# EAGLE schematic CarloopXL-v3.0 (EAGLE 7.5.0)
DATABASE: /home/monkbroc/Electronics/eagle/PARTSDB.tsv
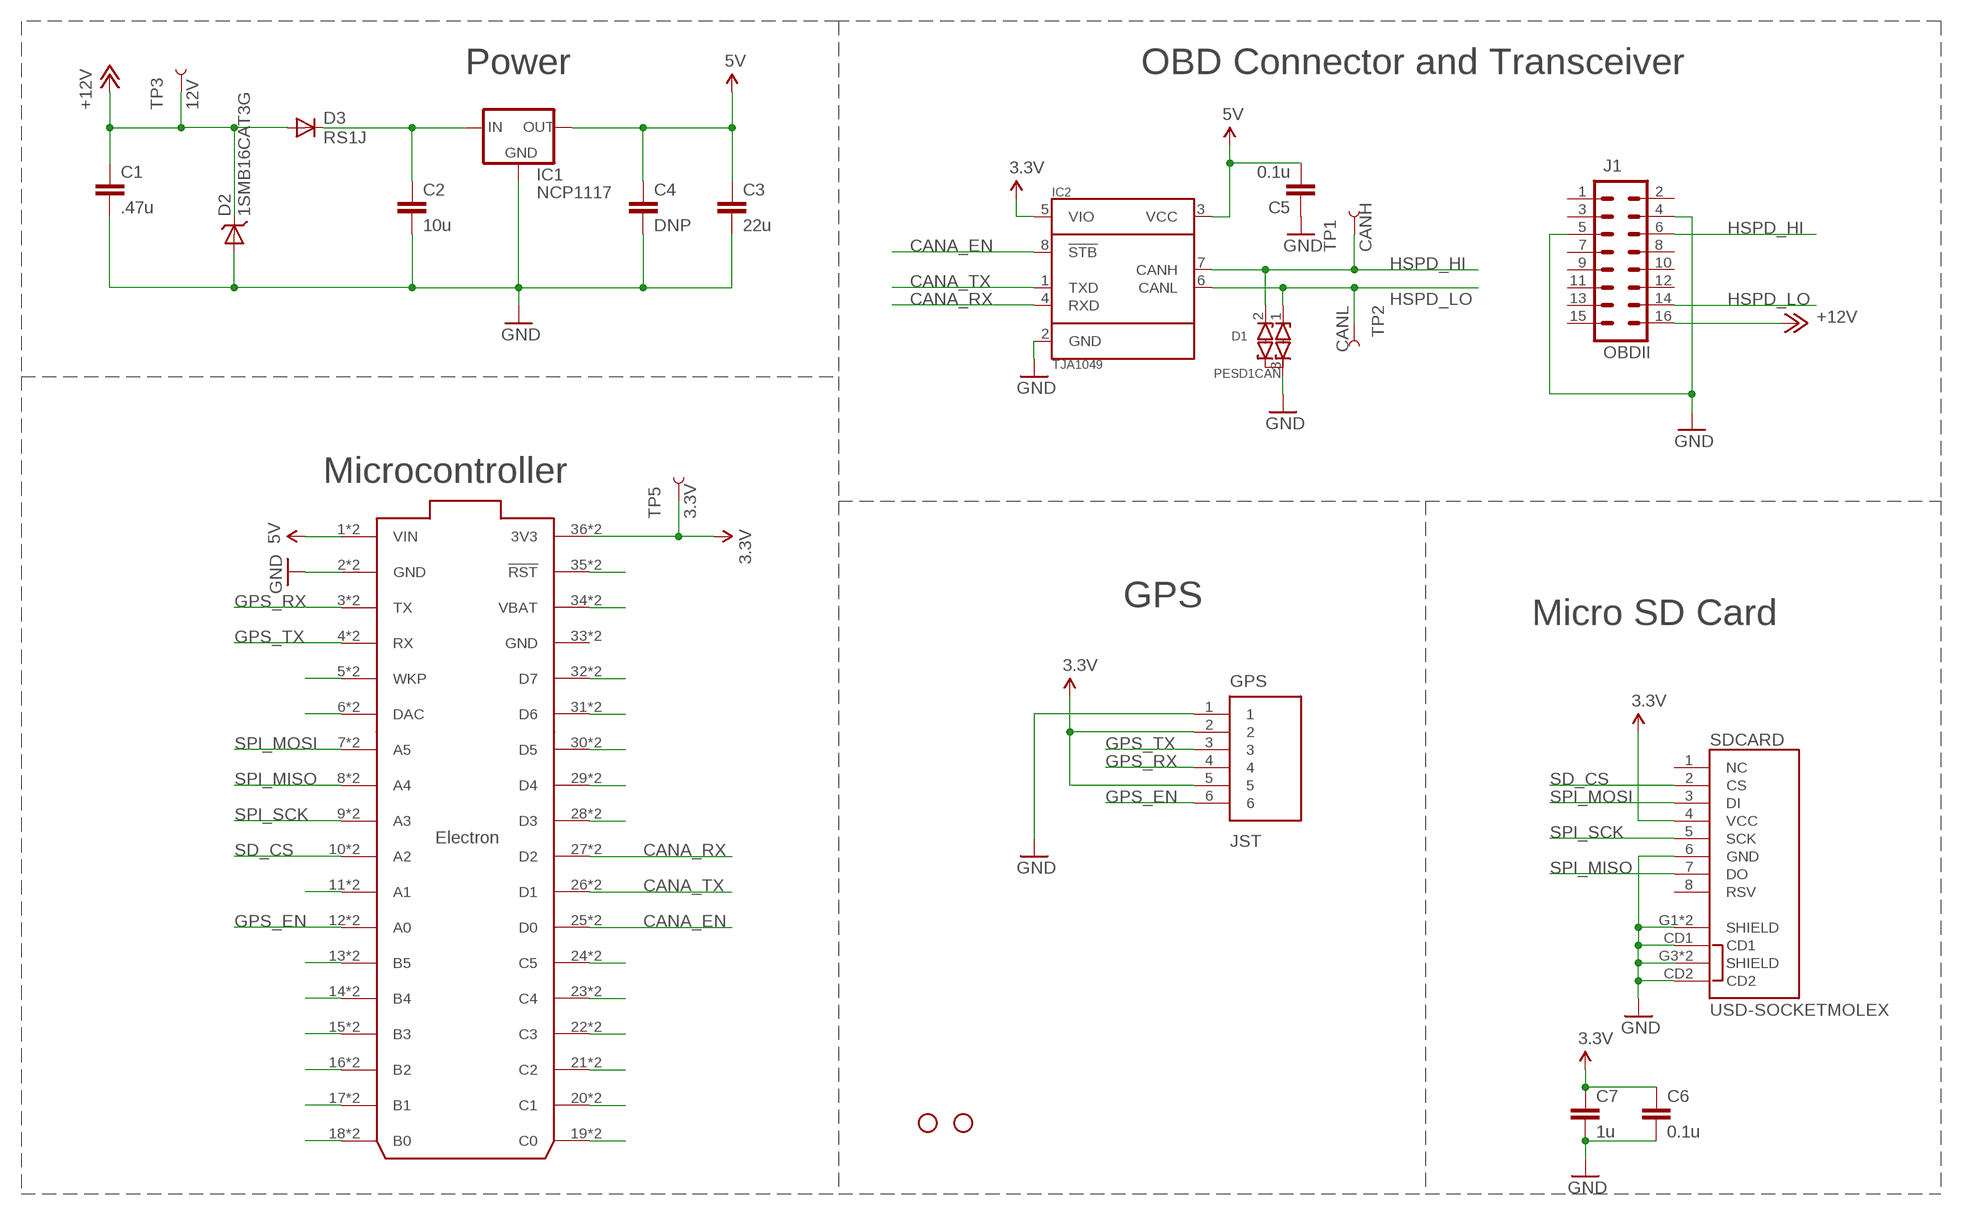
[diagram p0: schematic, sheet 1]

## Parts
C1  .47u  C-EUC0805  [C0805]
C2  10u  C-EUC0805  [C0805]
C3  22u  C-EUC0805  [C0805]
C4  DNP  C-EUC0805  [C0805]
C5  0.1u  C-EUC0805  [C0805]
C6  0.1u  C-EUC0805  [C0805]
C7  1u  C-EUC0805  [C0805]
D1  PESD1CAN  DIODE_ESD_DUAL-SOT-23  [SOT23]
D2  1SMB16CAT3G  DIODE-TVS-SMB  [SMB-DIODE]
D3  RS1J  DIODESMA  [SMA-DIODE]
ELECTRON  ELECTRON_WITH_EXTERNAL_HEADERS  [ELECTRON_EXTERNAL]
GPS  JST  [JST-6-SMD-VERT-1.0MM]
IC1  NCP1117  [SOT223]
IC2  TJA1049  [SO8]
J1  OBDII  M08X2-OBDII-COMTECH  [OBDII-COMTECH]
SDCARD  USD-SOCKETMOLEX  [MICRO-SD-MOLEX]
STANDOFF1  STAND-OFF  [STAND-OFF]
STANDOFF2  STAND-OFF  [STAND-OFF]
TP1  CANH  TEST-POINT3  [PAD.03X.03]
TP2  CANL  TEST-POINT3  [PAD.03X.03]
TP3  12V  TEST-POINT3  [PAD.03X.03]
TP5  3.3V  TEST-POINT3  [PAD.03X.03]

## Nets
3.3V: C6.1 C7.1 ELECTRON.36(3V3) ELECTRON.@36(3V3) GPS.2 GPS.5 IC2.5(VIO) SDCARD.4(VCC) TP5.P$1
5V [power]: C3.1 C4.1 C5.2 ELECTRON.1(VIN) ELECTRON.@1(VIN) IC1.3(OUT) IC1.4(OUT) IC2.3(VCC)
+12V [power]: C1.1 D2.C D3.A J1.16 TP3.P$1
CANA_EN: ELECTRON.25(D0) ELECTRON.@25(D0) IC2.8(!STB)
CANA_RX: ELECTRON.27(D2) ELECTRON.@27(D2) IC2.4(RXD)
CANA_TX: ELECTRON.26(D1) ELECTRON.@26(D1) IC2.1(TXD)
GND: C1.2 C2.2 C3.2 C4.2 C5.1 C6.2 C7.2 D1.3(COM) D2.A ELECTRON.2(GND) ELECTRON.@2(GND) GPS.1 IC1.1(GND) IC2.2(GND) J1.4 J1.5 SDCARD.6(GND) SDCARD.CD1 SDCARD.CD2 SDCARD.G1(SHIELD) SDCARD.G2(SHIELD) SDCARD.G3(SHIELD) SDCARD.G4(SHIELD)
GPS_EN: ELECTRON.12(A0) ELECTRON.@12(A0) GPS.6
GPS_RX: ELECTRON.3(TX) ELECTRON.@3(TX) GPS.4
GPS_TX: ELECTRON.4(RX) ELECTRON.@4(RX) GPS.3
HSPD_HI: D1.2(C2) IC2.7(CANH) J1.6 TP1.P$1
HSPD_LO: D1.1(C1) IC2.6(CANL) J1.14 TP2.P$1
N$1: ELECTRON.13(B5) ELECTRON.@13(B5)
N$7: ELECTRON.14(B4) ELECTRON.@14(B4)
N$10: ELECTRON.35(!RST) ELECTRON.@35(!RST)
N$11: ELECTRON.34(VBAT) ELECTRON.@34(VBAT)
N$12: ELECTRON.32(D7) ELECTRON.@32(D7)
N$13: ELECTRON.31(D6) ELECTRON.@31(D6)
N$14: ELECTRON.30(D5) ELECTRON.@30(D5)
N$15: ELECTRON.29(D4) ELECTRON.@29(D4)
N$16: ELECTRON.28(D3) ELECTRON.@28(D3)
N$17: ELECTRON.15(B3) ELECTRON.@15(B3)
N$18: ELECTRON.11(A1) ELECTRON.@11(A1)
N$19: ELECTRON.16(B2) ELECTRON.@16(B2)
N$20: ELECTRON.17(B1) ELECTRON.@17(B1)
N$21: ELECTRON.18(B0) ELECTRON.@18(B0)
N$22: ELECTRON.19(C0) ELECTRON.@19(C0)
N$23: ELECTRON.20(C1) ELECTRON.@20(C1)
N$24: ELECTRON.21(C2) ELECTRON.@21(C2)
N$25: ELECTRON.6(DAC) ELECTRON.@6(DAC)
N$26: ELECTRON.5(WKP) ELECTRON.@5(WKP)
N$27: ELECTRON.23(C4) ELECTRON.@23(C4)
N$28: ELECTRON.24(C5) ELECTRON.@24(C5)
N$29: ELECTRON.22(C3) ELECTRON.@22(C3)
N$31 [power]: C2.1 D3.C IC1.2(IN)
SD_CS: ELECTRON.10(A2) ELECTRON.@10(A2) SDCARD.2(CS)
SPI_MISO: ELECTRON.8(A4) ELECTRON.@8(A4) SDCARD.7(DO)
SPI_MOSI: ELECTRON.7(A5) ELECTRON.@7(A5) SDCARD.3(DI)
SPI_SCK: ELECTRON.9(A3) ELECTRON.@9(A3) SDCARD.5(SCK)
Unconnected: J1.1 J1.2 J1.3 J1.7 J1.8 J1.9 J1.10 J1.11 J1.12 J1.13 J1.15 SDCARD.1(NC) SDCARD.8(RSV)

## Notes on the sheet
- Power | OBD Connector and Transceiver
- Microcontroller
- GPS
- Micro SD Card

## Power pins joined to a net without a drawn wire
GND: ELECTRON.33(GND) ELECTRON.@33(GND)

## Library data of the parts
C1 = rcl:C-EU: CAPACITOR, European symbol; PARTNO: C0805C474K5RACTU
C2 = rcl:C-EU: CAPACITOR, European symbol; PARTNO: GRM21BR6YA106KE43L
C3 C4 = rcl:C-EU: CAPACITOR, European symbol; PARTNO: GRM219R61A226MEA0D
C5 C6 = rcl:C-EU: CAPACITOR, European symbol; PARTNO: 08055C104KAT2A
C7 = rcl:C-EU: CAPACITOR, European symbol; PARTNO: CC0805KKX7R7BB105
D1 = MuniRent:DIODE_ESD_DUAL: Dual ESD Diode, with a common anode; PARTNO: PESD1CAN-215
D2 = BUG:DIODE-TVS; PARTNO: 1SMB16CAT3G; ROLE: Overvoltage protection
D3 = BUG:DIODE: Diode These are standard reverse protection diodes and small signal diodes. SMA package can handle up to about 1A. SOD-323 can handle about 200mA. What the SOD-323 package when ordering, there are some mfgs out there that are 5-pin packages.; PARTNO: RS1J-E3/5AT; ROLE: Reverse protection
ELECTRON = MuniRent:ELECTRON; PARTNO: PPTC181LFBN-RC
GPS = MuniRent:JST; PARTNO: BM06B-SRSS-TB; PROD_ID: CONN-08249
IC1 = MuniRent:NCP1117; PARTNO: NCP1117LPST50T3G
IC2 = MuniRent:TJA1049; PARTNO: TJA1049T-118
J1 = MuniRent:M08X2: .1" headers, two rows of 8 each; PARTNO: OBD-II
SDCARD = MuniRent:USD-SOCKET: microSD Socket Push-push type uSD socket. Schematic element and footprint production proven. Spark Fun Electronics SKU : PRT-00127. tDoc lines correctly indicate media card edge positions when inserting (unlocked, locked, depressed). NOTE: CD1 and CD2 are connected internally; PARTNO: 1040310811
STANDOFF1 STANDOFF2 = SparkFun-Electromechanical:STAND-OFF: #4 Stand Off This is the mechanical footprint for a #4 phillips button head screw. Use the keepout ring to avoid running the screw head into surrounding components. SKU : PRT-00447
TP1-TP3 TP5 = SparkFun-Passives:TEST-POINT: Bare copper test points for troubleshooting or ICT

## Net classes
0 default: width 0.254 mm
1 power: width 0.813 mm, clearance 0.406 mm